# EAGLE design LB_o1_LED-v03(rev2) (EAGLE 6.6.0)
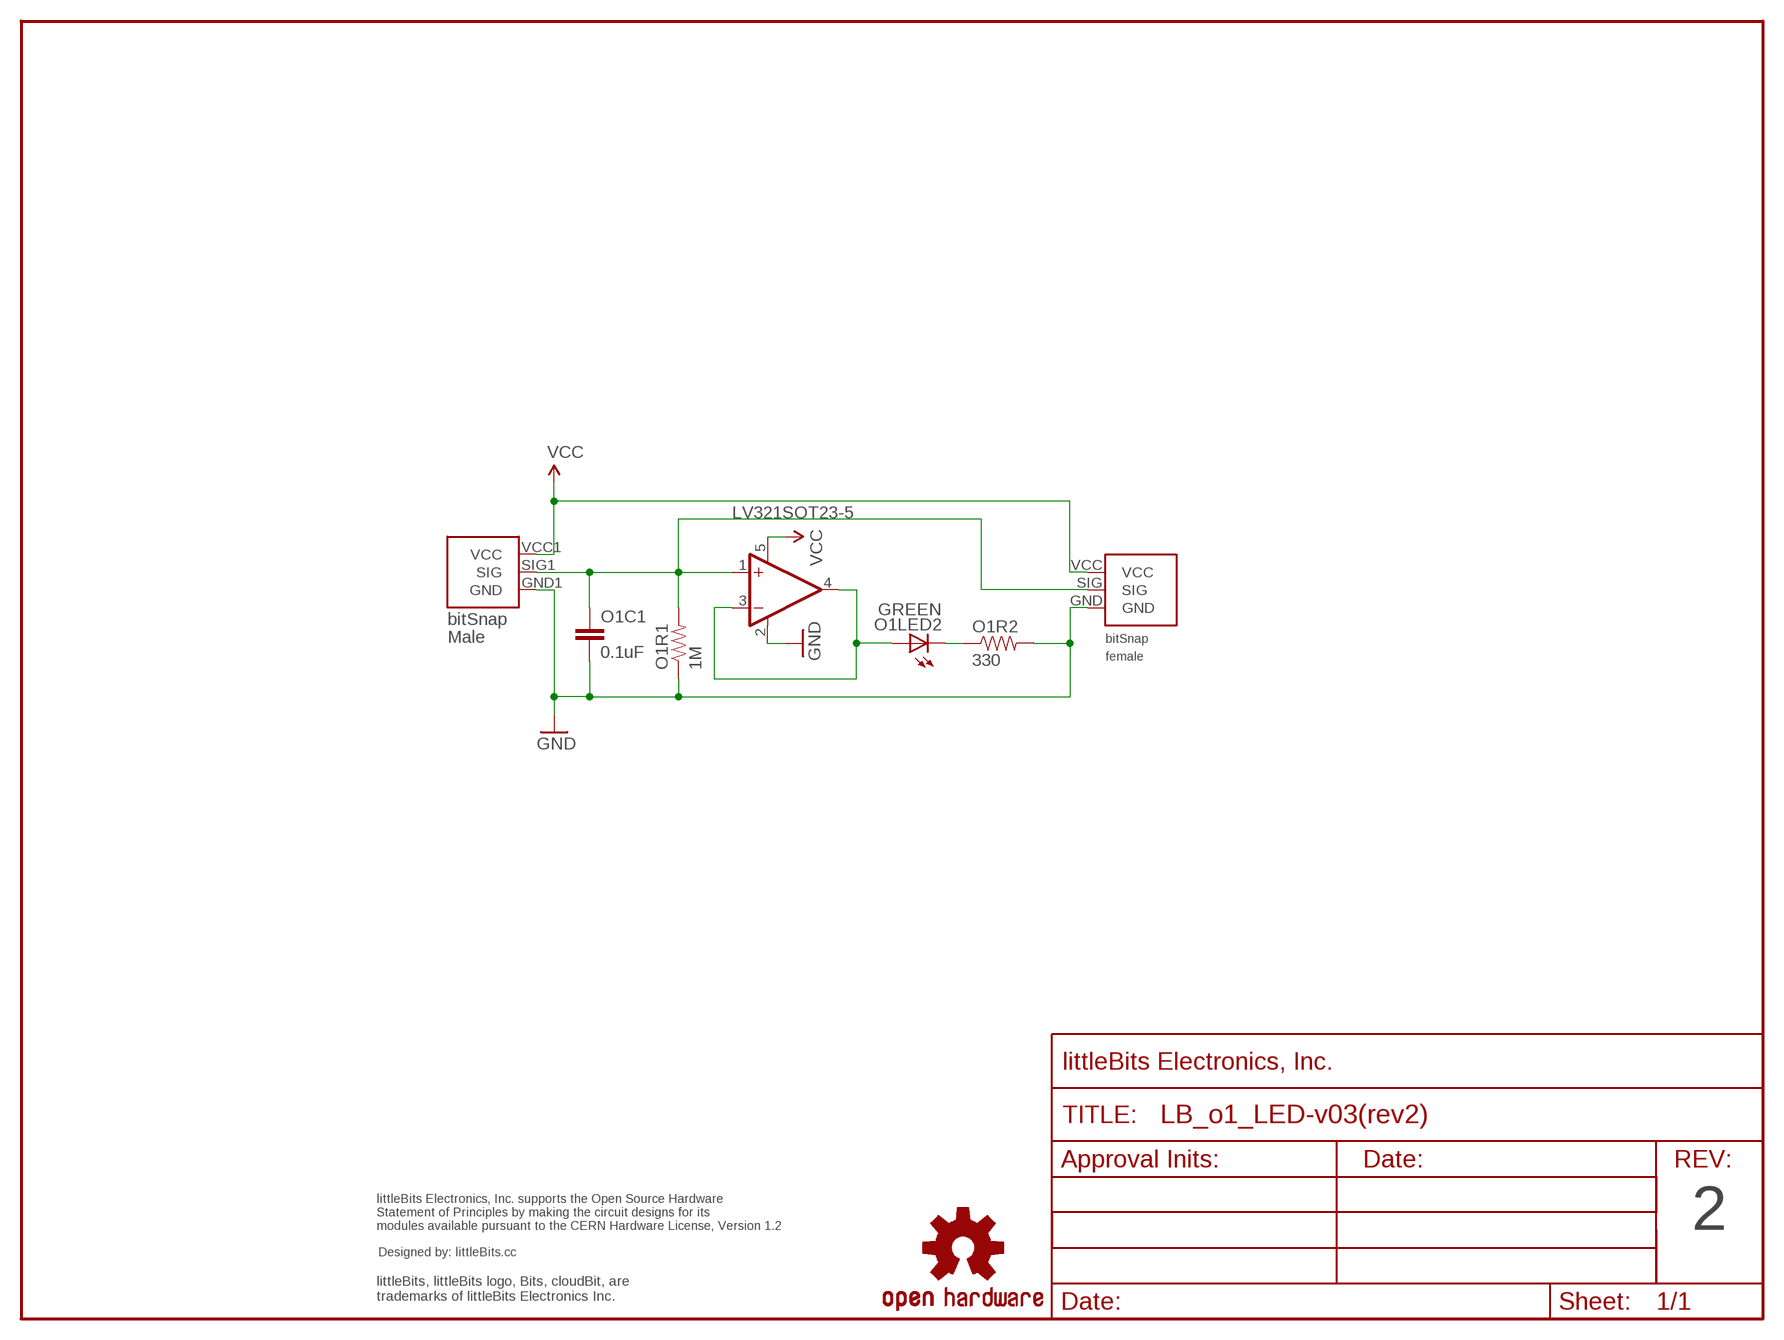
[diagram p0: schematic, sheet 1]

## Parts
O1BSF  BITSNAP_V03_FEMALE  [BITSNAP_V03_FEMALE]
O1BSM  BITSNAP_V03_MALE  [BITSNAP_V03_MALE]
O1C1  0.1uF  CAP0603-CAP  [0603-CAP]
O1LED2  GREEN  LED1206  [LED-1206]
O1R1  1M  RESISTOR0603-RES  [0603-RES]
O1R2  330  RESISTOR0603-RES  [0603-RES]
O1U1  LV321SOT23-5  [SOT23-5]
U$1  OSHWCREDIT  [OSHWCREDIT]
U$3  OSHW-LOGOL  [OSHW-LOGO-L]
U$4  FRAME-LETTER-OHWOHW  [FABDWG01-OHW]

## Nets
GND: O1BSF.GND O1BSM.GND1(GND) O1C1.2 O1R1.1 O1R2.2 O1U1.2(V-)
LEDGND: O1LED2.C O1R2.1
N$1: O1LED2.A O1U1.3(-IN) O1U1.4(OUT)
SIG: O1BSF.SIG O1BSM.SIG1(SIG) O1C1.1 O1R1.2 O1U1.1(+IN)
VCC: O1BSF.VCC O1BSM.VCC1(VCC) O1U1.5(V+)

## Notes on the sheet
- 2

## Library data of the parts
O1BSF = bitSnap:BITSNAP_V03_FEMALE
O1BSM = bitSnap:BITSNAP_V03_MALE
O1C1 = SparkFun:CAP: Capacitor Standard 0603 ceramic capacitor, and 0.1" leaded capacitor.
O1LED2 = SparkFun:LED: LEDs Standard schematic elements and footprints for 5mm, 3mm, 1206, and 0603 sized LEDs. 5mm - Spark Fun Electronics SKU : COM-00529 (and others)
O1R1 O1R2 = SparkFun:RESISTOR: Resistor Basic schematic elements and footprints for 0603, 1206, and PTH 1/10th watt (small) resistors.
O1U1 = LITTLEBITS:LV321
U$1 = LITTLEBITS:OSHWCREDIT
U$3 = LITTLEBITS:OSHW-LOGO: Open Source Hardware Logo This logo indicates the piece of hardware it is found on incorporates a OSHW license and/or adheres to the definition of open source hardware found here: http://freedomdefined.org/OSHW
U$4 = LITTLEBITS:FRAME-LETTER-OHW

## Board
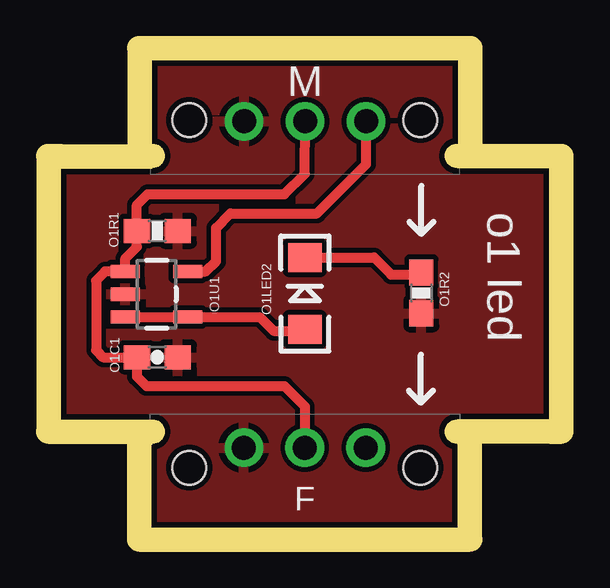
[diagram p1: board, top side]
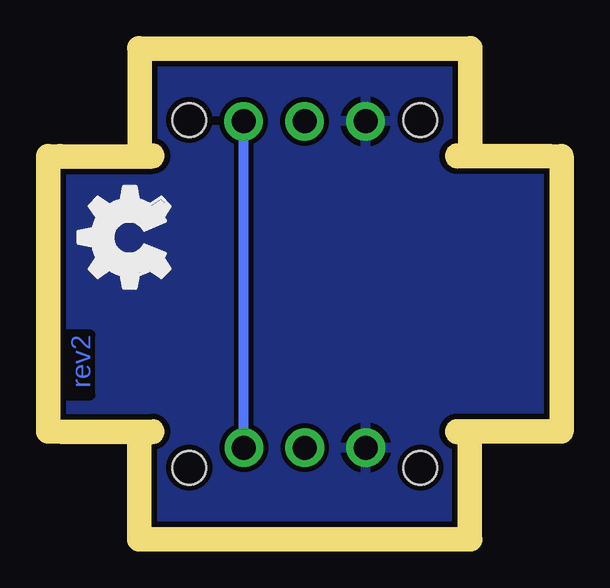
[diagram p2: board, bottom side, seen from below]

Size 20.4 x 19.5 mm. Coordinates in mm from the lower left corner, seen from the top.
Outline: 0,15 0,4.5
Outline: 20.4,4.5 20.4,15
Copper layers (1*16): Top 0.035mm / dielectric 1.5mm / Bottom 0.035mm
Design rules "default": minimum track width 8mil, minimum drill 20mil, track to track 8mil, track to pad 8mil, pad to pad 8mil, via to via 8mil, smd to smd 8mil, copper to edge 10mil, drill to drill 8mil, minimum pad ring 12mil, minimum via ring 10mil, stop-mask expansion 4mil, vias tented up to drill 25mil, thermal gap 10mil
Milling: 6 lines

### Footprints (pad centres in the part's own frame; a part is rotated, then mirrored left to right if it is on the bottom)
BITSNAP_V03_FEMALE = drill 1: GND 3.91,3.33; SIG 6.45,3.33; VCC 8.99,3.33 | hole 1.4: 1.63,2.5; 11.27,2.5
BITSNAP_V03_MALE = drill 1: GND1 8.98,2.56; SIG1 6.44,2.56; VCC1 3.9,2.56 | hole 1.4: 11.27,2.5; 1.63,2.5
0603-CAP = smd 1.1 x 1: 1 -0.85,0; 2 0.85,0
LED-1206 = smd 1.2 x 1.4: A -1.5,0; C 1.5,0
0603-RES = smd 1.1 x 1: 1 -0.85,0; 2 0.85,0
SOT23-5 = smd 0.55 x 1.2: 1 -0.95,-1.3; 2 0,-1.3; 3 0.95,-1.3; 4 0.95,1.3; 5 -0.95,1.3

### Placement (x,y rotation side)
O1BSF  3.75,0 0 top
O1BSM  16.65,19.5 180 top
O1C1  4.06,7.1 0 top
O1LED2  10.21,9.76 90 top
O1R1  4.06,12.37 180 top
O1R2  15.06,9.79 270 top
O1U1  4.03,9.73 270 top
U$1  -95.05,-65.05 0 top  (outside the outline)
U$2  [OSHW_FILLX150_NOTEXT]  15.82,9.15 0 top
U$3  -34.27,-70.16 0 top  (outside the outline)
U$4  0.3,0.25 0 top

### Tracks (layer width: path | path; a pad name or v marks a point on that pad's centre or on a via)
GND
  pour Top: 0.25,19.25 20.15,19.25 20.15,0.25 0.25,0.25
  pour Bottom: 0.25,19.25 20.15,19.25 20.15,0.25 0.25,0.25
LEDGND
  Top 0.406: O1LED2.C 13.09,11.26 13.8,10.55 15.02,10.55 O1R2.1
N$1
  Top 0.406: O1U1.3 O1U1.4 8.32,8.78 8.9,8.2 10.14,8.2 O1LED2.A
SIG
  Top 0.406: O1BSF.SIG 10.2,5.05 9.35,5.9 3.6,5.9 3.21,6.29 O1C1.1 3.25,7.1 1.8,7.1 1.5,7.4 1.5,10.3 1.88,10.68 O1U1.1 2.72,11.22 3.2,11.7 O1R1.2 3.21,13.46 3.65,13.9 9.35,13.9 10.2,14.75 O1BSM.SIG1
VCC
  Top 0.406: O1U1.5 6.08,10.68 6.5,11.1 6.5,12.5 7.1,13.1 10.7,13.1 12.75,15.15 O1BSM.VCC1
  Bottom 0.406: O1BSF.VCC O1BSM.VCC1

### Text on the board
Bottom: rev2
tPlace: o1 led
Milling: 1mm DIA. ROUTER PATH
dxf: o1 LED BIT PCB | 2 | LB-BITo1-LED-v03-GERBER-rev2 (8-31-2012)